# Altium schematic sheet Comms.SchDoc
size A
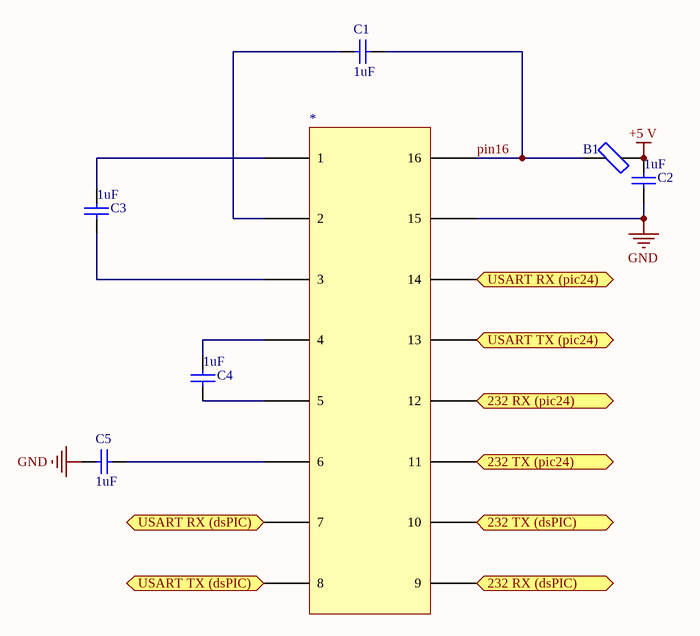
[diagram p0: Comms.SchDoc]

## Parts
*  MAX232E  [SO-16_M]  (value not drawn)
B1  Ferrite Bead  [Resistor 0603]  (value not drawn)
C1  value 1uF  [Capacitor 0603]  (hidden comment: 1uF Ceramic Low ESR)
C2  value 1uF  [Capacitor 0603]  (hidden comment: 1uF Ceramic Low ESR)
C3  value 1uF  [Capacitor 0603]  (hidden comment: 1uF Ceramic Low ESR)
C4  value 1uF  [Capacitor 0603]  (hidden comment: 1uF Ceramic Low ESR)
C5  value 1uF  [Capacitor 0603]  (hidden comment: 1uF Ceramic Low ESR)

## Ports
232 RX (dsPIC) (out), 232 RX (pic24) (out), 232 TX (dsPIC) (in), 232 TX (pic24) (in), USART RX (dsPIC) (out), USART RX (pic24) (out), USART TX (dsPIC) (in), USART TX (pic24) (in)

## Nets
+5 V: B1.1 C2.1
GND: *.15 C2.2 C5.1
232 RX (dsPIC): *.9 ; port 232 RX (dsPIC)
232 RX (pic24): *.12 ; port 232 RX (pic24)
232 TX (dsPIC): *.10 ; port 232 TX (dsPIC)
232 TX (pic24): *.11 ; port 232 TX (pic24)
pin16: *.16 B1.2 C1.2
USART RX (dsPIC): *.7 ; port USART RX (dsPIC)
USART RX (pic24): *.14 ; port USART RX (pic24)
USART TX (dsPIC): *.8 ; port USART TX (dsPIC)
USART TX (pic24): *.13 ; port USART TX (pic24)
Net*_1: *.1 C3.1
Net*_2: *.2 C1.1
Net*_3: *.3 C3.2
Net*_4: *.4 C4.1
Net*_5: *.5 C4.2
Net*_6: *.6 C5.2

## Library data of the parts
* = max232
B1 = Ferrite Bead: Ferrite Bead: 200 Ohm @ 25 Mhz
C1-C5 = Cap Semi: Capacitor (Semiconductor SIM Model); Published: 8-Jun-2000; LatestRevisionDate: 29-May-2009; LatestRevisionNote: IPC-7351 Footprint Added.; PackageReference: C1206; Publisher: Altium Limited; PackageDescription: Chip Capacitor